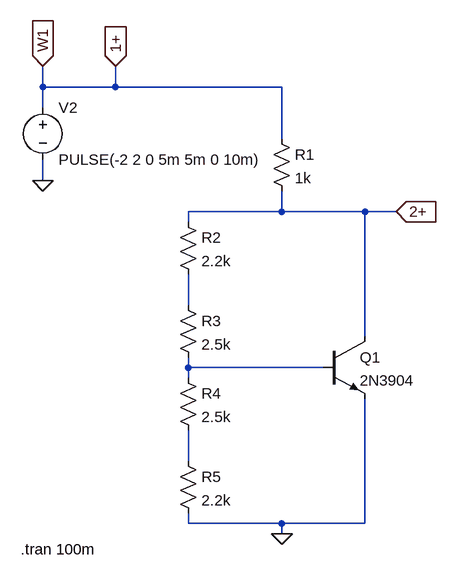
[diagram p0: schematic vbe_multiplier.asc]
vbe_multiplier.asc, the LTspice schematic file:
Version 4
SHEET 1 880 680
WIRE -96 -48 -96 -80
WIRE 16 -48 16 -80
WIRE 16 -48 -96 -48
WIRE 272 -48 16 -48
WIRE -96 -16 -96 -48
WIRE 272 32 272 -48
WIRE -96 96 -96 64
WIRE 272 144 272 112
WIRE 272 144 128 144
WIRE 400 144 272 144
WIRE 448 144 400 144
WIRE 128 160 128 144
WIRE 128 288 128 240
WIRE 400 336 400 144
WIRE 128 384 128 368
WIRE 336 384 128 384
WIRE 128 400 128 384
WIRE 128 528 128 480
WIRE 128 624 128 608
WIRE 272 624 128 624
WIRE 400 624 400 432
WIRE 400 624 272 624
WIRE 272 640 272 624
FLAG 272 640 0
FLAG -96 96 0
FLAG -96 -80 W1
IOPIN -96 -80 In
FLAG 16 -80 1+
IOPIN 16 -80 In
FLAG 448 144 2+
IOPIN 448 144 In
SYMBOL res 256 16 R0
SYMATTR InstName R1
SYMATTR Value 1k
SYMBOL res 112 144 R0
SYMATTR InstName R2
SYMATTR Value 2.2k
SYMBOL res 112 272 R0
SYMATTR InstName R3
SYMATTR Value 2.5k
SYMBOL res 112 384 R0
SYMATTR InstName R4
SYMATTR Value 2.5k
SYMBOL res 112 512 R0
SYMATTR InstName R5
SYMATTR Value 2.2k
SYMBOL npn 336 336 R0
SYMATTR InstName Q1
SYMATTR Value 2N3904
SYMBOL voltage -96 -32 R0
WINDOW 123 0 0 Left 0
WINDOW 39 0 0 Left 0
SYMATTR InstName V2
SYMATTR Value PULSE(-2 2 0 5m 5m 0 10m)
TEXT -130 664 Left 2 !.tran 100m

The netlist it stands for:
* vbe_multiplier.asc
R1 1+ 2+ 1k
R2 2+ N001 2.2k
R3 N001 N002 2.5k
R4 N002 N003 2.5k
R5 N003 0 2.2k
Q1 2+ N002 0 0 2N3904
V2 1+ 0 PULSE(-2 2 0 5m 5m 0 10m)
.model NPN NPN
.model PNP PNP
.lib standard.bjt
.tran 100m
.backanno
.end